# EAGLE schematic Teensyboard (EAGLE 9.6.2)

## Sheet 1 of 2: Main MCU
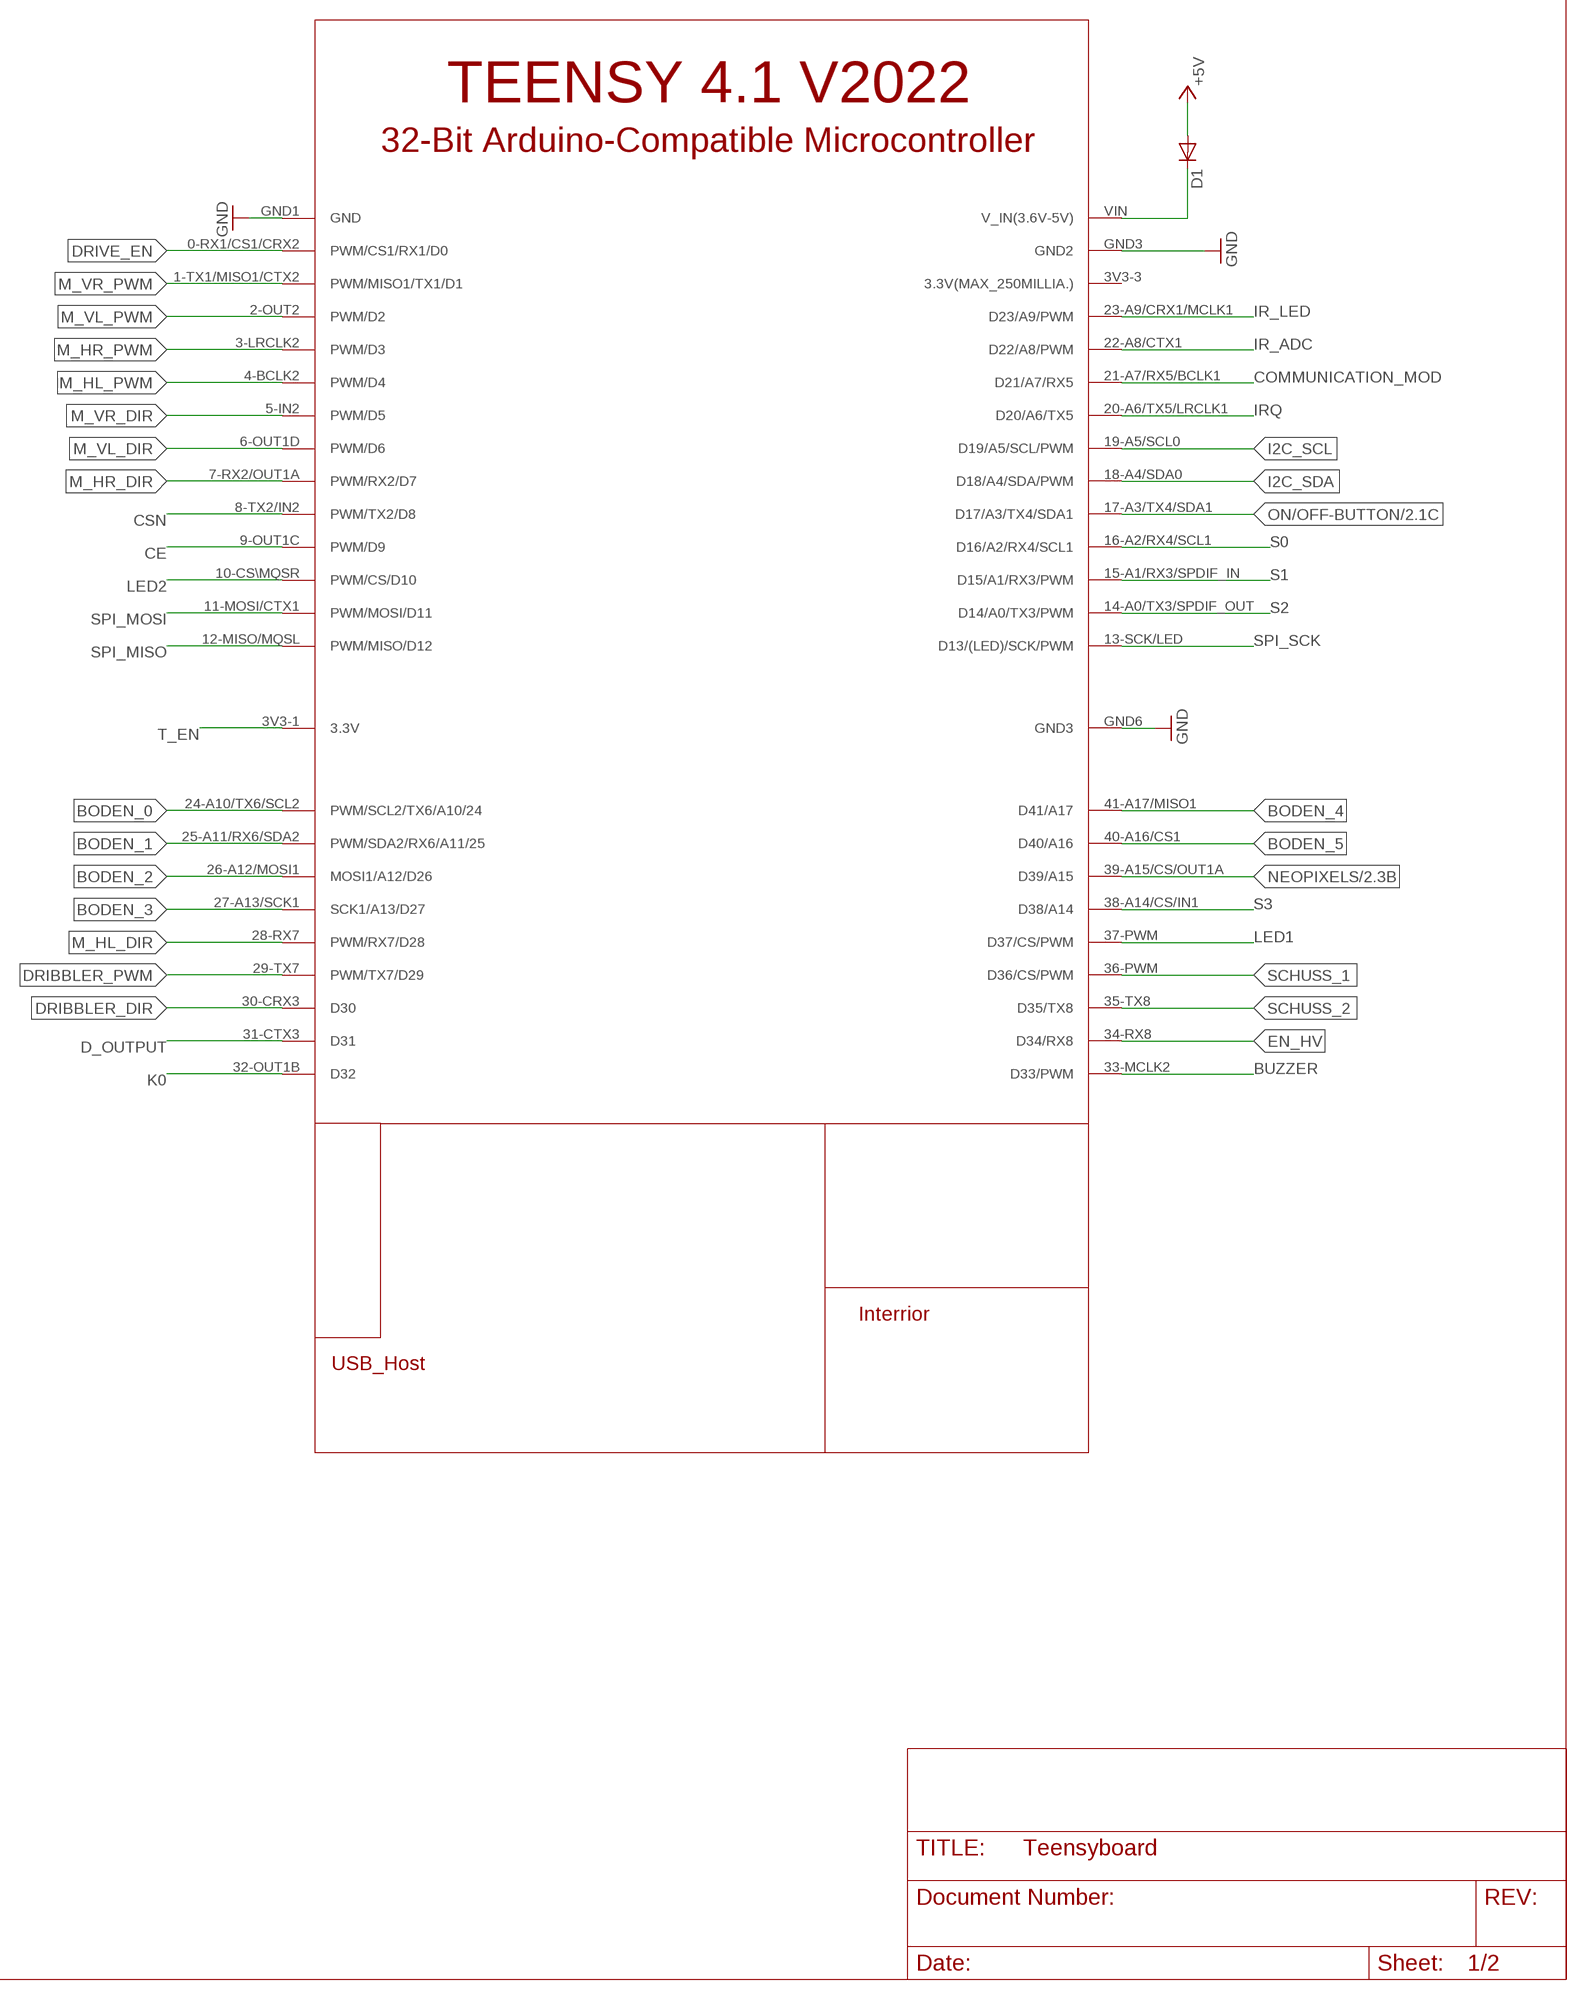
[diagram p0: schematic, sheet 1, part 1 of 2]
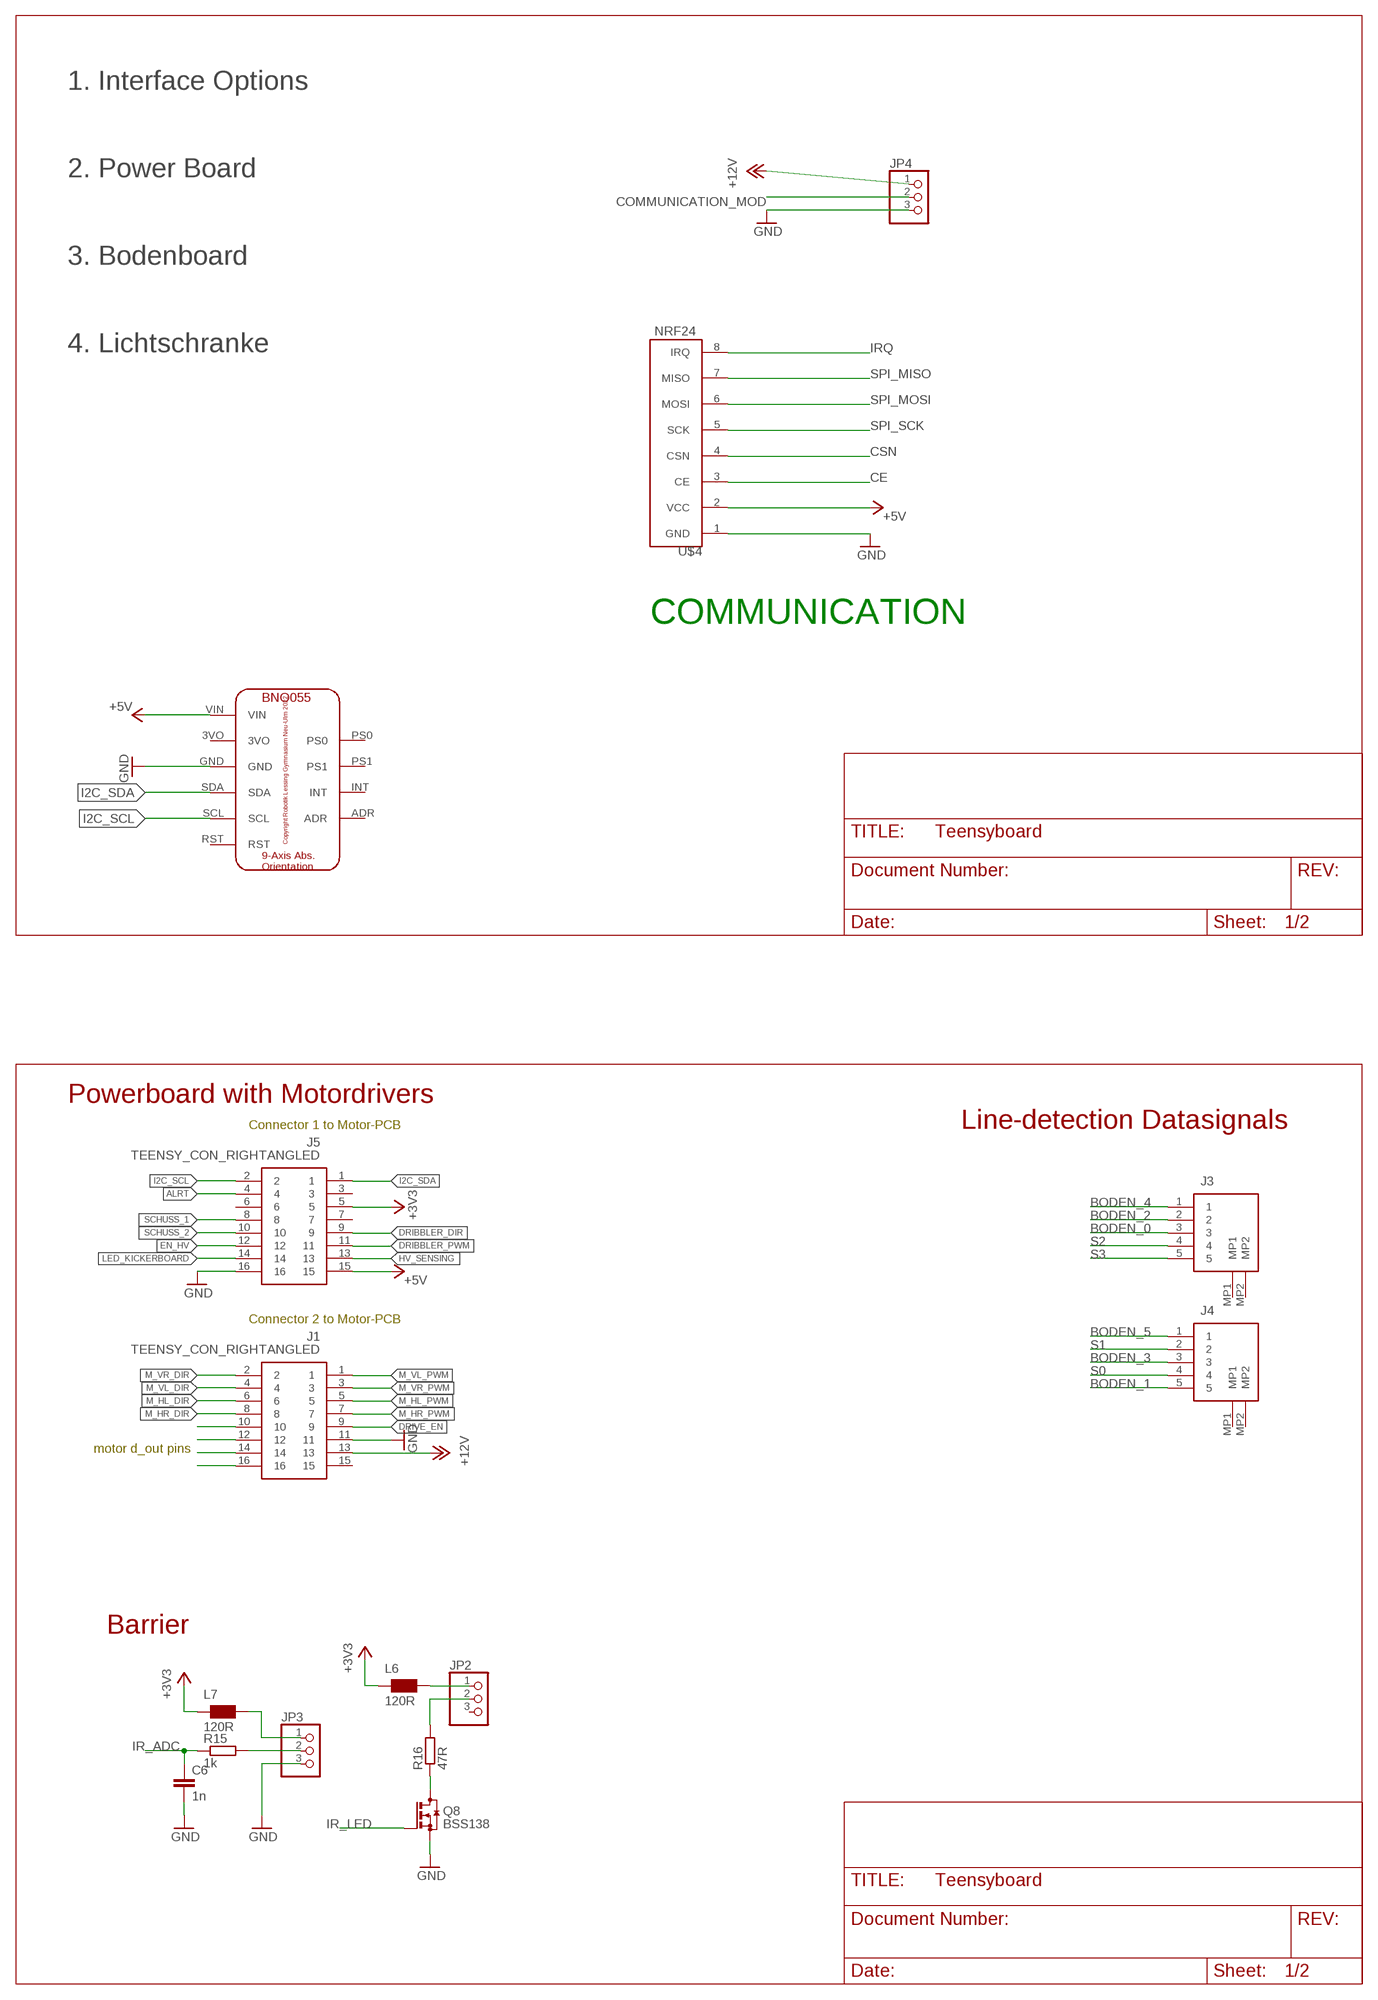
[diagram p1: schematic, sheet 1, part 2 of 2]

### Parts
C6  1n  C-EUC0603  [C0603]
D1  DIODE-SMB  [SMB]
J1  TEENSY_CON_RIGHTANGLED  [208659-1640_SHDRRA16W55P200_2X8_1800X1450X]
J3  5PIN_1MM_CON  [2035600503]
J4  5PIN_1MM_CON  [2035600503]
J5  TEENSY_CON_RIGHTANGLED  [208659-1640_SHDRRA16W55P200_2X8_1800X1450X]
JP2  PINHD-1X3  [1X03]
JP3  PINHD-1X3  [1X03]
JP4  PINHD-1X3  [1X03]
L6  120R  WE-CBF_0603  [0603]
L7  120R  WE-CBF_0603  [0603]
Q8  BSS138  BSS123  [SOT23]
R15  1k  R-EU_R0603  [R0603]
R16  47R  R-EU_R0603  [R0603]
U$2  BNO055  [BNO055]
U$3  TEENSY_4.1_WO_EXTRAPINS  [TEENSY_4.1_WO_EXTRAPINS]
U$4  NRF24  [NRF24]

### Nets
+3V3: J5.5 L6.1 L7.1
+5V: D1.A J5.15 U$2.VIN U$4.2(VCC) ; also sheet 2
+12V: J1.13 JP4.1 ; also sheet 2
ALRT: J5.4
BODEN_0: J3.3 U$3.24-A10/TX6/SCL2(PWM/SCL2/TX6/A10/24)
BODEN_1: J4.5 U$3.25-A11/RX6/SDA2(PWM/SDA2/RX6/A11/25)
BODEN_2: J3.2 U$3.26-A12/MOSI1(MOSI1/A12/D26)
BODEN_3: J4.3 U$3.27-A13/SCK1(SCK1/A13/D27)
BODEN_4: J3.1 U$3.41-A17/MISO1(D41/A17)
BODEN_5: J4.1 U$3.40-A16/CS1(D40/A16)
BUZZER: U$3.33-MCLK2(D33/PWM) ; also sheet 2
CE: U$3.9-OUT1C(PWM/D9) U$4.3(CE)
COMMUNICATION_MOD: JP4.2 U$3.21-A7/RX5/BCLK1(D21/A7/RX5)
CSN: U$3.8-TX2/IN2(PWM/TX2/D8) U$4.4(CSN)
D_OUTPUT: U$3.31-CTX3(D31) ; also sheet 2
DRIBBLER_DIR: J5.9 U$3.30-CRX3(D30)
DRIBBLER_PWM: J5.11 U$3.29-TX7(PWM/TX7/D29)
DRIVE_EN: J1.9 U$3.0-RX1/CS1/CRX2(PWM/CS1/RX1/D0)
EN_HV: J5.12 U$3.34-RX8(D34/RX8)
GND: C6.2 J1.11 J5.16 JP3.3 JP4.3 Q8.2(S) U$2.GND U$3.GND1(GND) U$3.GND3(GND2) U$3.GND6(GND3) U$4.1(GND) ; also sheet 2
HV_SENSING: J5.13
I2C_SCL: J5.2 U$2.SCL U$3.19-A5/SCL0(D19/A5/SCL/PWM)
I2C_SDA: J5.1 U$2.SDA U$3.18-A4/SDA0(D18/A4/SDA/PWM)
IR_ADC: C6.1 R15.1 U$3.22-A8/CTX1(D22/A8/PWM)
IR_LED: Q8.1(G) U$3.23-A9/CRX1/MCLK1(D23/A9/PWM)
IRQ: U$3.20-A6/TX5/LRCLK1(D20/A6/TX5) U$4.8(IRQ)
K0: U$3.32-OUT1B(D32) ; also sheet 2
LED1: U$3.37-PWM(D37/CS/PWM) ; also sheet 2
LED2: U$3.10-CS\MQSR(PWM/CS/D10) ; also sheet 2
LED_KICKERBOARD: J5.14
M_HL_DIR: J1.6 U$3.28-RX7(PWM/RX7/D28)
M_HL_PWM: J1.5 U$3.4-BCLK2(PWM/D4)
M_HR_DIR: J1.8 U$3.7-RX2/OUT1A(PWM/RX2/D7)
M_HR_PWM: J1.7 U$3.3-LRCLK2(PWM/D3)
M_VL_DIR: J1.4 U$3.6-OUT1D(PWM/D6)
M_VL_PWM: J1.1 U$3.2-OUT2(PWM/D2)
M_VR_DIR: J1.2 U$3.5-IN2(PWM/D5)
M_VR_PWM: J1.3 U$3.1-TX1/MISO1/CTX2(PWM/MISO1/TX1/D1)
N$12: J1.10
N$24: J1.12
N$25: J1.14
N$26: J1.16
N$40: JP3.2 R15.2
N$52: D1.C U$3.VIN(V_IN(3.6V-5V))
N$53: Q8.3(D) R16.1
N$54: JP2.2 R16.2
N$77: JP3.1 L7.2
N$96: JP2.1 L6.2
NEOPIXELS: U$3.39-A15/CS/OUT1A(D39/A15) ; also sheet 2
ON/OFF-BUTTON: U$3.17-A3/TX4/SDA1(D17/A3/TX4/SDA1) ; also sheet 2
S0: J4.4 U$3.16-A2/RX4/SCL1(D16/A2/RX4/SCL1) ; also sheet 2
S1: J4.2 U$3.15-A1/RX3/SPDIF_IN(D15/A1/RX3/PWM) ; also sheet 2
S2: J3.4 U$3.14-A0/TX3/SPDIF_OUT(D14/A0/TX3/PWM) ; also sheet 2
S3: J3.5 U$3.38-A14/CS/IN1(D38/A14) ; also sheet 2
SCHUSS_1: J5.8 U$3.36-PWM(D36/CS/PWM)
SCHUSS_2: J5.10 U$3.35-TX8(D35/TX8)
SPI_MISO: U$3.12-MISO/MQSL(PWM/MISO/D12) U$4.7(MISO)
SPI_MOSI: U$3.11-MOSI/CTX1(PWM/MOSI/D11) U$4.6(MOSI)
SPI_SCK: U$3.13-SCK/LED(D13/(LED)/SCK/PWM) U$4.5(SCK)
T_EN: U$3.3V3-1(3.3V) ; also sheet 2
Unconnected: J1.15 J3.MP1 J3.MP2 J4.MP1 J4.MP2 J5.3 J5.6 J5.7 JP2.3 U$2.3VO U$2.ADR U$2.INT U$2.PS0 U$2.PS1 U$2.RST U$3.3V3-3(3.3V(MAX_250MILLIA.))

### Notes on the sheet
- 1. Interface Options
  
  
  2. Power Board
  
  
  3. Bodenboard
  
  
  4. Lichtschranke
- COMMUNICATION
- Powerboard with Motordrivers
- Connector 1 to Motor-PCB | Line-detection Datasignals
- Connector 2 to Motor-PCB
- motor d_out pins
- Barrier

## Sheet 2 of 2: Interface options
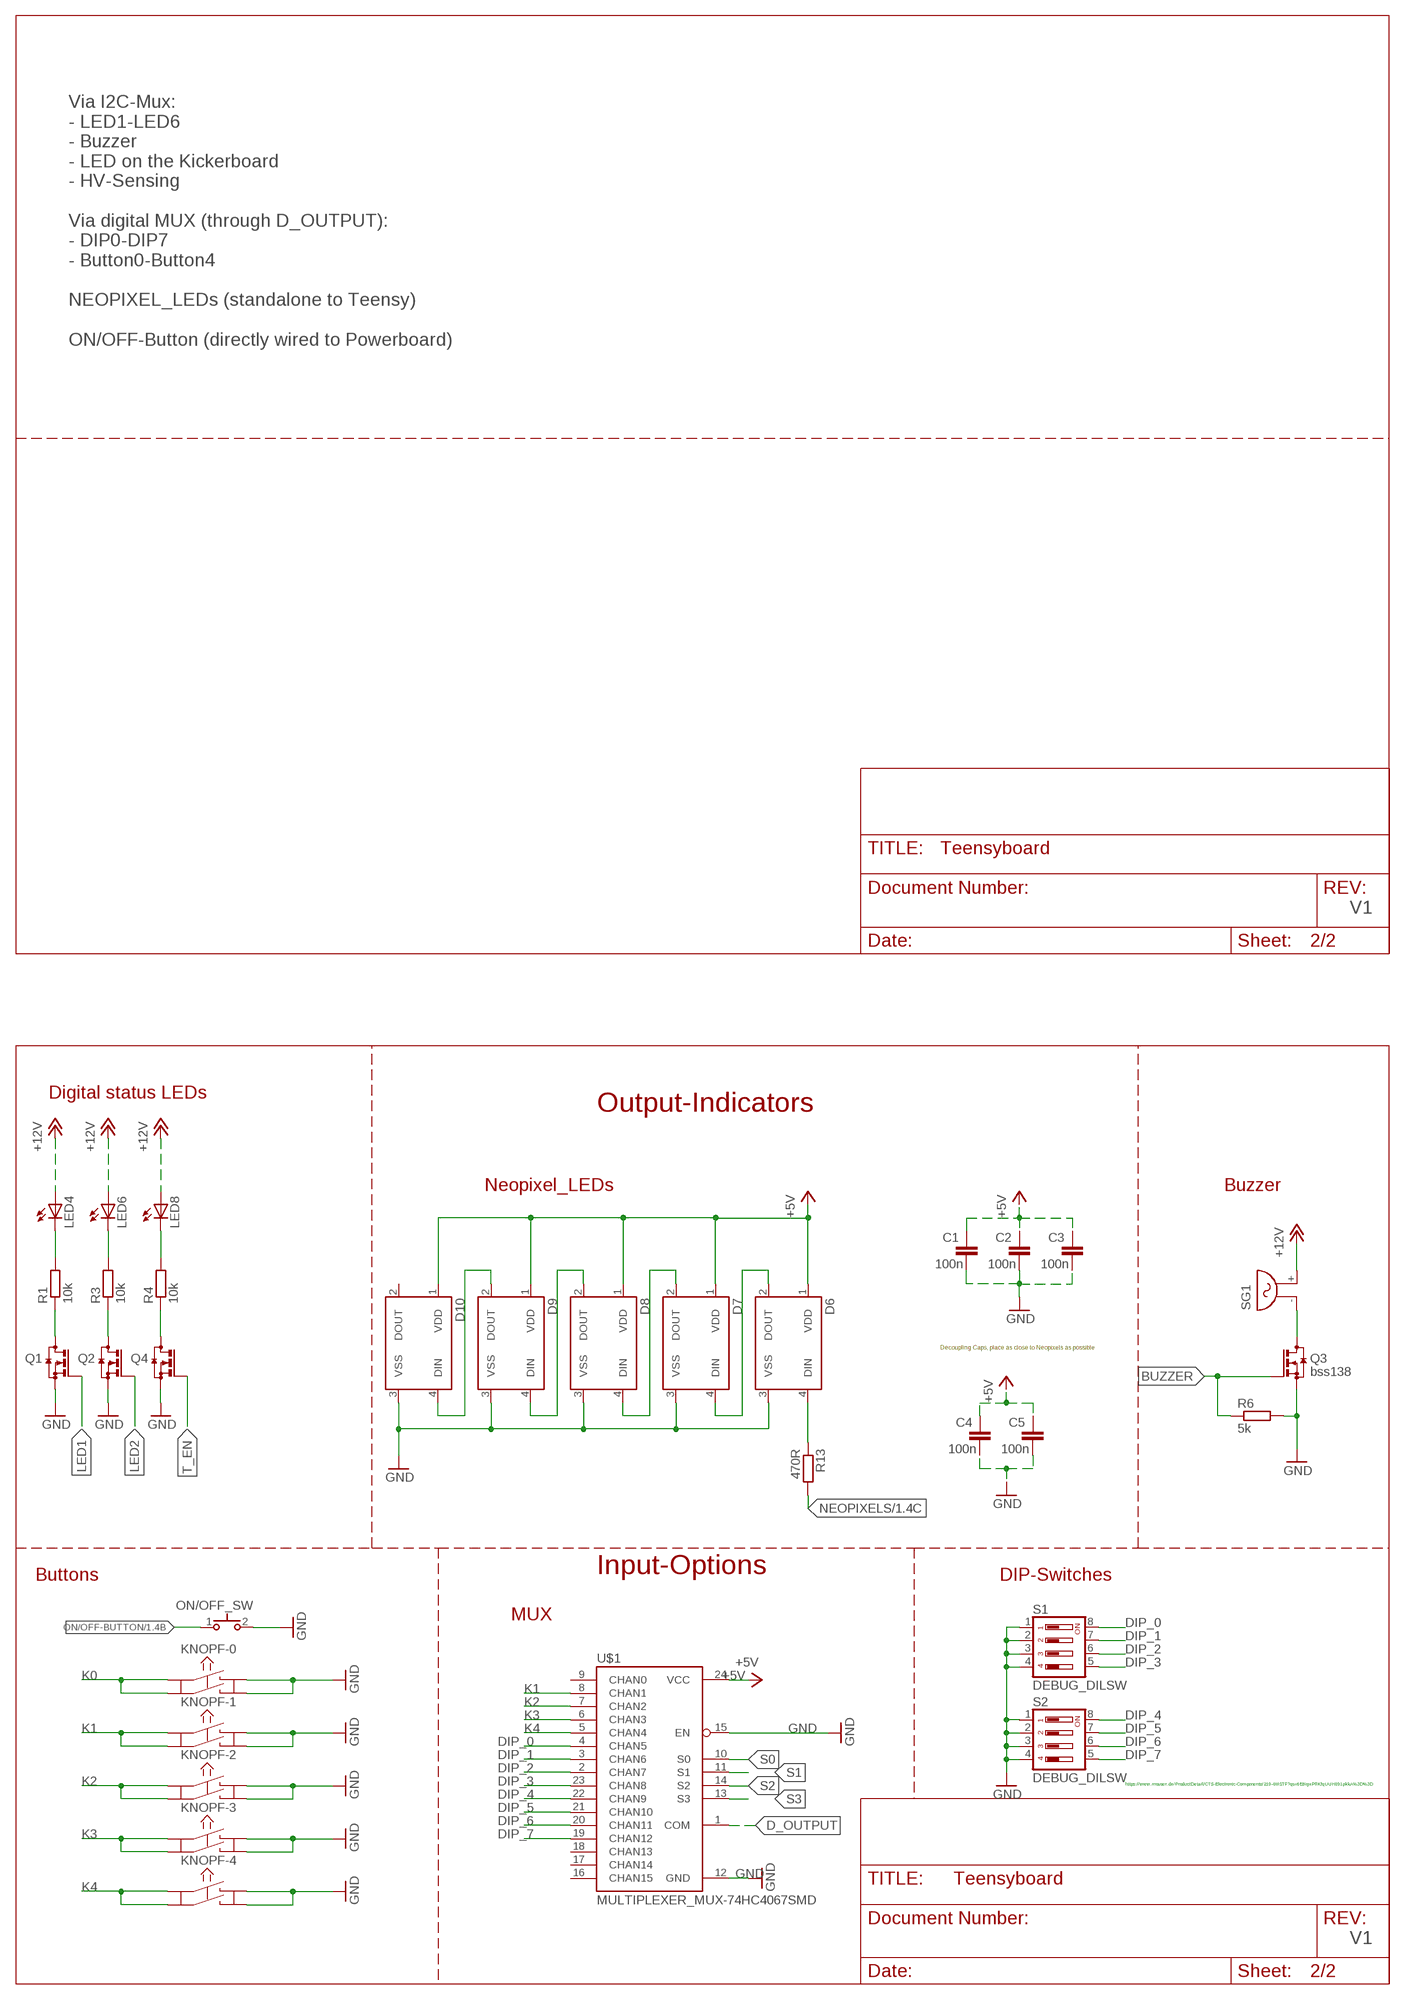
[diagram p2: schematic, sheet 2]

### Parts
C1  100n  C-EUC0805  [C0805]
C2  100n  C-EUC0805  [C0805]
C3  100n  C-EUC0805  [C0805]
C4  100n  C-EUC0805  [C0805]
C5  100n  C-EUC0805  [C0805]
D6  DEBUG_WS2812B  [SPARKFUN-LED_WS2812B]
D7  DEBUG_WS2812B  [SPARKFUN-LED_WS2812B]
D8  DEBUG_WS2812B  [SPARKFUN-LED_WS2812B]
D9  DEBUG_WS2812B  [SPARKFUN-LED_WS2812B]
D10  DEBUG_WS2812B  [SPARKFUN-LED_WS2812B]
KNOPF-0  KSM611A  [KSM611A]
KNOPF-1  KSM611A  [KSM611A]
KNOPF-2  KSM611A  [KSM611A]
KNOPF-3  KSM611A  [KSM611A]
KNOPF-4  KSM611A  [KSM611A]
LED4  POWER_LED-GREEN-CHIPLED_0805  [POWER_DISTRIBUTION_CHIPLED_0805]
LED6  POWER_LED-GREEN-CHIPLED_0805  [POWER_DISTRIBUTION_CHIPLED_0805]
LED8  POWER_LED-GREEN-CHIPLED_0805  [POWER_DISTRIBUTION_CHIPLED_0805]
ON/OFF_SW  POWER_BUTTONS  [TIGERS_KT11]
Q1  bss138  TRANSISTOR_BSS123  [TRANSISTOR-SMALL-SIGNAL_SOT23]
Q2  bss138  TRANSISTOR_BSS123  [TRANSISTOR-SMALL-SIGNAL_SOT23]
Q3  bss138  TRANSISTOR_BSS123  [TRANSISTOR-SMALL-SIGNAL_SOT23]
Q4  bss138  TRANSISTOR_BSS123  [TRANSISTOR-SMALL-SIGNAL_SOT23]
R1  10k  R-EU_R0603  [R0603]
R3  10k  R-EU_R0603  [R0603]
R4  10k  R-EU_R0603  [R0603]
R6  5k  R-EU_R0603  [R0603]
R13  470R  R-EU_R0603  [R0603]
S1  DEBUG_DILSW  [SWITCH-DIL_CTS-219-04]
S2  DEBUG_DILSW  [SWITCH-DIL_CTS-219-04]
SG1  DEBUG_BUZZER  [BUZZER_F/QMX]
U$1  MULTIPLEXER_MUX-74HC4067SMD  [SPARKFUN_SSOP24]

### Nets
+5V: C1.2 C2.2 C3.2 C4.2 C5.2 D6.1(VDD) D7.1(VDD) D8.1(VDD) D9.1(VDD) D10.1(VDD) U$1.24(VCC) ; also sheet 1
+12V: LED4.A LED6.A LED8.A SG1.+ ; also sheet 1
BUZZER: Q3.1(G) R6.1 ; also sheet 1
D_OUTPUT: U$1.1(COM) ; also sheet 1
DIP_0: S1.8 U$1.4(CHAN5)
DIP_1: S1.7 U$1.3(CHAN6)
DIP_2: S1.6 U$1.2(CHAN7)
DIP_3: S1.5 U$1.23(CHAN8)
DIP_4: S2.8 U$1.22(CHAN9)
DIP_5: S2.7 U$1.21(CHAN10)
DIP_6: S2.6 U$1.20(CHAN11)
DIP_7: S2.5 U$1.19(CHAN12)
GND: C1.1 C2.1 C3.1 C4.1 C5.1 D6.3(VSS) D7.3(VSS) D8.3(VSS) D9.3(VSS) D10.3(VSS) KNOPF-0.B KNOPF-0.D KNOPF-1.B KNOPF-1.D KNOPF-2.B KNOPF-2.D KNOPF-3.B KNOPF-3.D KNOPF-4.B KNOPF-4.D ON/OFF_SW.2 Q1.2(S) Q2.2(S) Q3.2(S) Q4.2(S) R6.2 S1.1 S1.2 S1.3 S1.4 S2.1 S2.2 S2.3 S2.4 U$1.12(GND) U$1.15(EN) ; also sheet 1
K0: KNOPF-0.A KNOPF-0.C ; also sheet 1
K1: KNOPF-1.A KNOPF-1.C U$1.8(CHAN1)
K2: KNOPF-2.A KNOPF-2.C U$1.7(CHAN2)
K3: KNOPF-3.A KNOPF-3.C U$1.6(CHAN3)
K4: KNOPF-4.A KNOPF-4.C U$1.5(CHAN4)
LED1: Q1.1(G) ; also sheet 1
LED2: Q2.1(G) ; also sheet 1
N$1: LED8.C R4.2
N$5: LED4.C R1.2
N$7: LED6.C R3.2
N$8: Q1.3(D) R1.1
N$9: Q4.3(D) R4.1
N$13: Q2.3(D) R3.1
N$15: Q3.3(D) SG1.-
N$19: D6.4(DIN) R13.1
N$20: D6.2(DOUT) D7.4(DIN)
N$21: D7.2(DOUT) D8.4(DIN)
N$22: D8.2(DOUT) D9.4(DIN)
N$23: D9.2(DOUT) D10.4(DIN)
NEOPIXELS: R13.2 ; also sheet 1
ON/OFF-BUTTON: ON/OFF_SW.1 ; also sheet 1
S0: U$1.10(S0) ; also sheet 1
S1: U$1.11(S1) ; also sheet 1
S2: U$1.14(S2) ; also sheet 1
S3: U$1.13(S3) ; also sheet 1
T_EN: Q4.1(G) ; also sheet 1
Unconnected: D10.2(DOUT) U$1.9(CHAN0) U$1.16(CHAN15) U$1.17(CHAN14) U$1.18(CHAN13)

### Notes on the sheet
- Via I2C-Mux:
  - LED1-LED6
  - Buzzer
  - LED on the Kickerboard
  - HV-Sensing
  
  Via digital MUX (through D_OUTPUT):
  - DIP0-DIP7
  - Button0-Button4
  
  NEOPIXEL_LEDs (standalone to Teensy)
  
  ON/OFF-Button (directly wired to Powerboard)
- V1
- Digital status LEDs
- Output-Indicators
- Neopixel_LEDs | Buzzer
- Decoupling Caps, place as close to Neopixels as possible
- Input-Options
- Buttons | DIP-Switches
- MUX
- https://www.mouser.de/ProductDetail/CTS-Electronic-Components/219-4MSTF?qs=6E8igxPflKfqUUH891pkkA%3D%3D
- V1

## Library data of the parts
C1-C6 = rcl:C-EU: CAPACITOR, European symbol; SPICEPREFIX: C
D1 = diode:DIODE-: DIODE
D6-D10 = Open24:DEBUG_WS2812B: WS2812B - Intelligent control LED integrated light source Technical Specifications: Power Supply Voltage (VDD): 3.5 to 5.3 V Input Voltage (VI): -0.5 to VDD+0.5 V Operating Junction Temperature (Topt): -25°C to +80°C Storage Temperature Range (Tstg): -55°C to +150°C; PROD_ID: DIO-12503
J1 J5 = Open24:TEENSY_CON_RIGHTANGLED: IGRID2.0 PLUGTHOLEHDR RA GF NAT 16CKT Source: Datasheet; DESCRIPTION: IGRID2.0 PLUGTHOLEHDR RA GF NAT 16CKT; HEIGHT: 8.5mm; MANUFACTURER_NAME: Molex; MANUFACTURER_PART_NUMBER: 208659-1640; MOUSER_PART_NUMBER: 538-208659-1640; MOUSER_PRICE-STOCK: https://www.mouser.co.uk/ProductDetail/Molex/208659-1640?qs=GedFDFLaBXEVd%2F074iDEfw%3D%3D
J3 J4 = 5PinConnector:5PIN_1MM_CON: Headers & Wire Housings PicoClasp Hdr SMT SR Vrt 5Ckt OPL Au0.38 Source: Datasheet <https://www.molex.com/pdm_docs/sd/2035600503_sd.pdf>; DESCRIPTION: Headers & Wire Housings PicoClasp Hdr SMT SR Vrt 5Ckt OPL Au0.38; HEIGHT: 5.61mm; MANUFACTURER_NAME: Molex; MANUFACTURER_PART_NUMBER: 203560-0503; MOUSER_PART_NUMBER: 538-203560-0503; MOUSER_PRICE-STOCK: https://www.mouser.co.uk/ProductDetail/Molex/203560-0503?qs=F5EMLAvA7IDMlfZodDQB8w%3D%3D
JP2-JP4 = pinhead:PINHD-1X3: PIN HEADER
KNOPF-0 KNOPF-1-KNOPF-4 = schalter_taster:KSM611A
L6 L7 = wuerth-elektronik:WE-CBF: SMD EMI Suppression Ferrite Beads - excellent anti-EMI properties - low DCR - impedances till 3000 ohms - rated current up to 6 A
LED4 LED6 LED8 = Open24:POWER_LED: LED; MF: Würth Elektronik; MPN: 150080GS75000
ON/OFF_SW = Open24:POWER_BUTTONS
Q1-Q4 = Open24:TRANSISTOR_BSS123: N-CHANNEL MOS FET
Q8 = transistor-small-signal:BSS123: N-CHANNEL MOS FET
R1 R3 R4 R6 R13 R15 R16 = rcl:R-EU_: RESISTOR, European symbol; SPICEPREFIX: R
S1 S2 = Open24:DEBUG_DILSW: Surface Mount DIP Switch Series 219 SMT CTS Electronic Components Sourc: www.ctscorp.com; OC_FARNELL: unknown; OC_NEWARK: unknown
SG1 = Open24:DEBUG_BUZZER: BUZZER Source: Buerklin CEM-1212S; OC_FARNELL: unknown; OC_NEWARK: unknown
U$1 = Open24:MULTIPLEXER_MUX-74HC4067
U$2 = Libsammlung:BNO055
U$3 = Libsammlung:TEENSY_4.1_WO_EXTRAPINS
U$4 = nrf24:NRF24

## Net classes
1 5v: width 0.813 mm, drill 0.8 mm